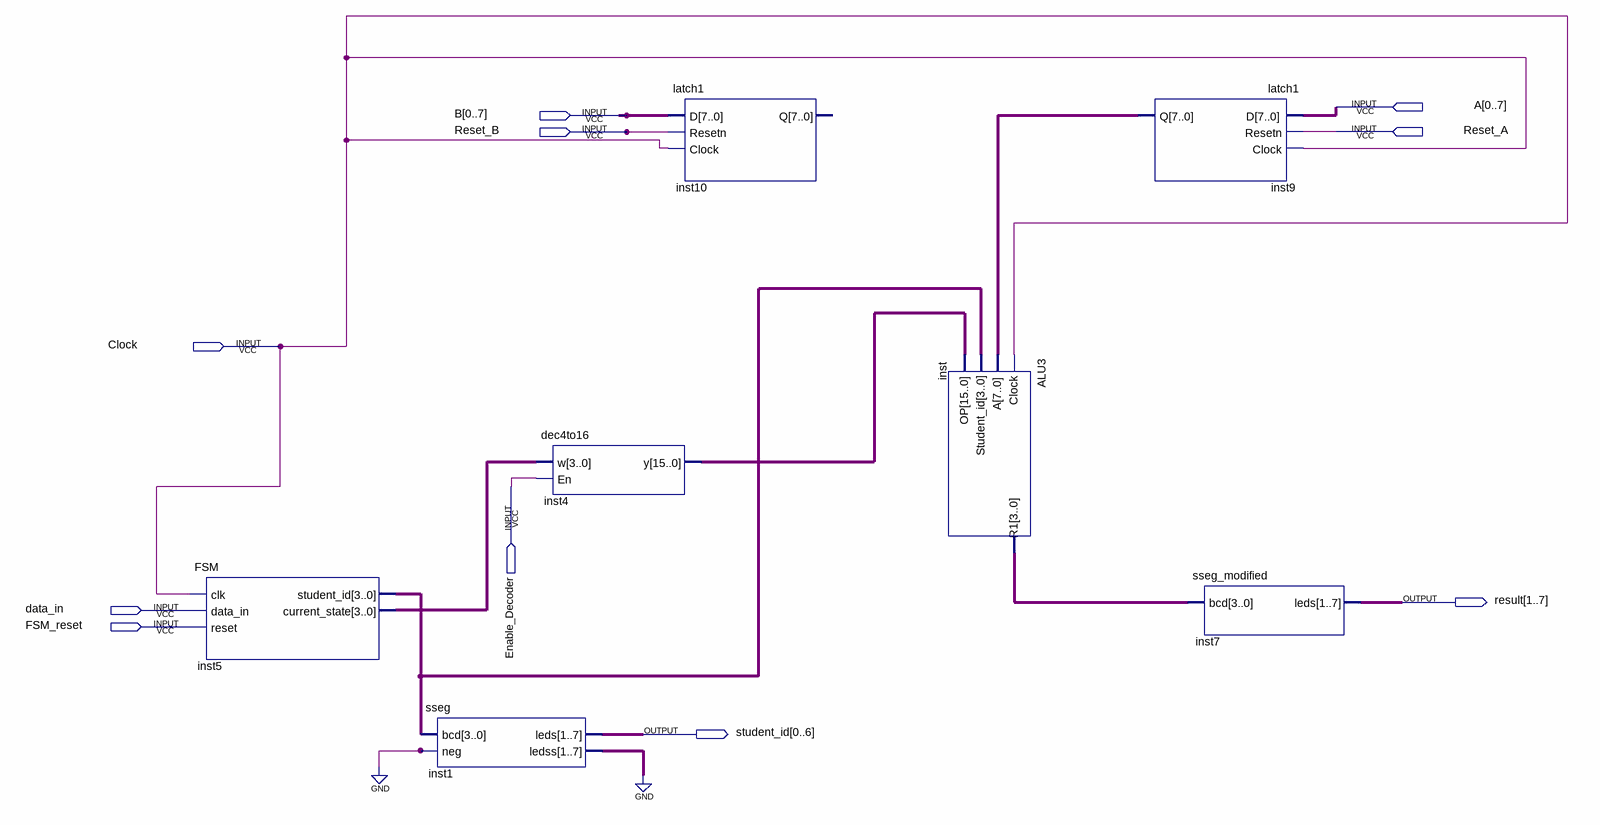
[diagram p0: schematic sheet]
// Quartus schematic DiagramC.bdf as structural Verilog: 7 symbols, 10 pins
module DiagramC (
  input  [0:7] A,
  input  [0:7] B,
  input  Reset_B,
  input  Reset_A,
  input  Clock,
  input  Enable_Decoder,
  input  data_in,
  input  FSM_reset,
  output [1:7] result,
  output [0:6] student_id
);

  wire [3:0] inst5_current_state, inst5_student_id, inst_r1;
  wire [6:0] inst1_ledss;
  wire [7:0] inst9_q;
  wire [15:0] inst4_y;

  FSM inst5 (.clk(Clock), .student_id(inst5_student_id), .current_state(inst5_current_state));  // open: data_in, reset
  sseg inst1 (.bcd(inst5_student_id), .neg(1'b0), .leds(student_id), .ledss(inst1_ledss));
  dec4to16 inst4 (.w(inst5_current_state), .En(Enable_Decoder), .y(inst4_y));
  latch1 inst10 (.D(B), .Resetn(Reset_B), .Clock(Clock));  // open: Q
  ALU3 inst (.Clock(Clock), .A(inst9_q), .Student_id(inst5_student_id), .OP(inst4_y), .R1(inst_r1));
  latch1 inst9 (.D(A), .Resetn(Reset_A), .Clock(Clock), .Q(inst9_q));
  sseg_modified inst7 (.bcd(inst_r1), .leds(result));
  // also tied to GND on the sheet: {inst1_ledss[0], inst1_ledss[1], inst1_ledss[2], inst1_ledss[3], inst1_ledss[4], inst1_ledss[5], inst1_ledss[6]}
endmodule
